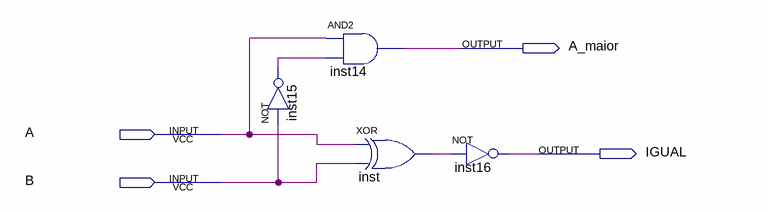
[diagram p0: schematic sheet]
// Quartus schematic Comparador_1bit.bdf as structural Verilog: 4 symbols, 4 pins
module Comparador_1bit (
  input  A,
  input  B,
  output A_maior,
  output IGUAL
);

  wire inst15_out, inst_out;

  not inst15 (inst15_out, B);
  and inst14 (A_maior, A, inst15_out);
  xor inst (inst_out, A, B);
  not inst16 (IGUAL, inst_out);
endmodule
